# Altium schematic sheet FPGA CONFIG.SchDoc: XC7A3G-JTAG
size A4; Date: 9 AUG 2026; Engineer: Parsa Malekpour; Revision: 1.0.0; SheetNumber: 7; SheetTotal: 18
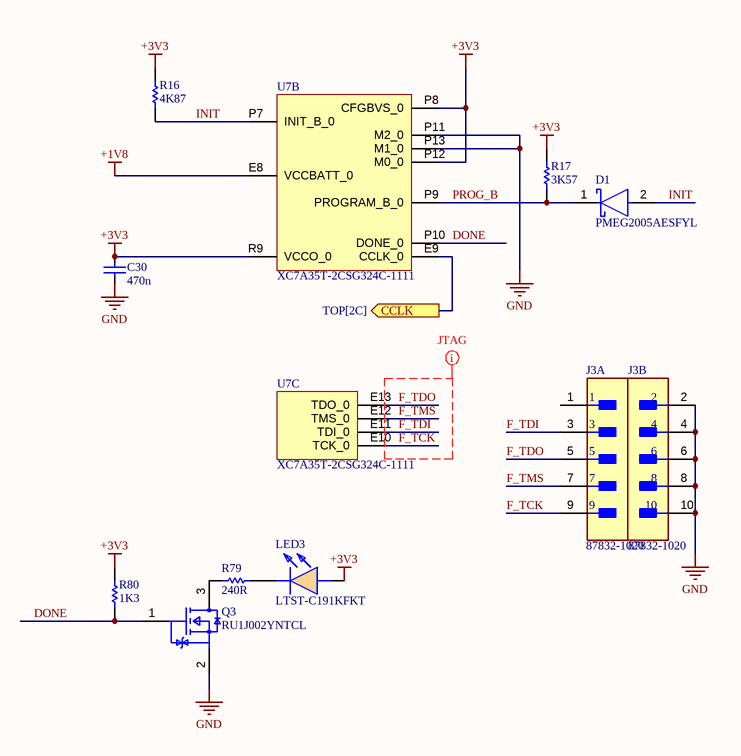
[diagram p0: FPGA CONFIG.SchDoc]

## Parts
C30  value 470n  [FP-C1005-050-0_05-IPC_C]  (hidden comment: C1005X5R1E474K050BB)
D1  PMEG2005AESFYL  [FP-PMEG2005AESFYL-MFG]
J3  87832-1020  [FP-87832-1020-MFG]  (parts A,B of 2)
LED3  LTST-C191KFKT  [LEDC1608X55N]
Q3  RU1J002YNTCL  [FP-UMT3F-MFG]
R16  value 4K87  [RESC1005X40X25LL05T10]  (hidden comment: RC0402FR-074K87L)
R17  value 3K57  [RESC1005X40X25LL05T10]  (hidden comment: RC0402FR-073K57L)
R79  value 240R  [RESC1005X40X25LL05T10]  (hidden comment: RC0402FR-07240RL)
R80  value 1K3  [RESC1005X40X25LL05T10]  (hidden comment: RC0402FR-071K3L)
U7  XC7A35T-2CSG324C-1111  [BGA324C80P18X18_1500X1500X150]  (parts B,C of 8)

## Ports
CCLK (out, see TOP[2C])

## Nets
+1V8: U7.E8(VCCBATT_0)
+3V3: C30.1 LED3.2(A) R16.2 R17.1 R80.2 U7.P8(CFGBVS_0) U7.P12(M0_0) U7.R9(VCCO_0)
GND: C30.2 J3.2 J3.4 J3.6 J3.8 J3.10 Q3.2(S) U7.P11(M2_0) U7.P13(M1_0)
CCLK: U7.E9(CCLK_0) ; port CCLK
DONE: Q3.1(G) R80.1 U7.P10(DONE_0)
F_TCK: J3.9 U7.E10(TCK_0)
F_TDI: J3.3 U7.E11(TDI_0)
F_TDO: J3.5 U7.E13(TDO_0)
F_TMS: J3.7 U7.E12(TMS_0)
INIT: D1.2(A) R16.1 U7.P7(INIT_B_0)
PROG_B: D1.1(K) R17.2 U7.P9(PROGRAM_B_0)
NetLED3_1: LED3.1(K) R79.2
NetQ3_3: Q3.3(D) R79.1

Not connected (* = marked no-connect by the designer): J3 1

## Layout directives
net class JTAG; rule Impedance Constraint [Min = 45.00    Max = 55.00    ]: F_TCK, F_TDI, F_TDO, F_TMS

## Notes on the sheet
- TITLE
- REV
- Date
- A4
- FILE NAME
- CODE
- SHEET
- Engineer
- OF

## Library data of the parts
C30 = C1005X5R1E474K050BB: Multilayer Ceramic Capacitors 470nF ±10% 25V X5R SMD 0402; Dissipation Factor: 10%; Case Code (Metric): 1005; RoHS Compliant: Yes; Lead Free: Lead Free; Length: 1mm; Case/Package: 0402; Termination: SMD/SMT; Dielectric Material: Ceramic; Dielectric: X5R; Depth: 0.5mm; Series: C; Voltage: 25V; Tolerance: 10%; Packaging: Tape and Reel; Resistor Type: Ceramic; Min Operating Temperature: -55°C; Width: 0.02inch; Thickness: 500um; Package Quantity: 10000; Case Code (Imperial): 0402; Construction: Flat; Height: 0.5mm; REACH SVHC: No SVHC; Radiation Hardening: No; Weight: 2.3E-05oz; Mount: Surface Mount; Voltage Rating (DC): 25V; Max Operating Temperature: 85°C; Part Number: C1005X5R1E474K050BB; Voltage Rating: 25V
D1 = PMEG2005AESFYL: DIODE SCHOTTKY 20V 0.5A SOD962; Manufacturer: Nexperia; Max Junction Temp: +150°C; Peak Reverse Current: 10uA; Capacitance: 25pF; Forward Current: 0.71A; Max Surge Forward Current: 4.5A; Value: 25pF; Lead Free: Yes; ComponentLink2Description: Datasheet; Octopart: https://octopart.com/pmeg2005aesfyl-nexperia-78741393; Ambient Temperature Range High: +150°C; Height: 0.32mm; Footprint Url: https://assets.nexperia.com/documents/outline-drawing/SOD962-2.pdf; Automotive: No; Device Class L2: Diodes; Ambient Temperature Range Low: -55°C; Device Class L3: Schottky Diodes; ComponentLink2URL: https://assets.nexperia.com/documents/data-sheet/PMEG2005AESF.pdf; Reverse Voltage: 20V; Temperature: to +150°C; Temperature Range High: +150°C; Device Class L1: Discrete Semiconductors; RoHS: TRUE; Digikey Description: DIODE SCHOTTKY 20V 0.5A SOD962; Category: Diode; Package: SOD962; Manufacturer Part Number: PMEG2005AESFYL
J3 = CMP-04776-000811-1: CONN HEADER SMD 10POS 2MM; Number of Positions: 10; Current Rating: 2A; Connector Type: Male Pin; Voltage Rating: 125V; Gender: Male; Row Spacing: 0.079inch; Contact Mating Length: 0.141inch; Contact Type: Male Pin; Series: Milli-Grid™ 87832; RoHS Compliant: Yes; Depth: 6.35mm; Orientation: Straight; Contact Material: Bronze; Mount: Surface Mount; Min Operating Temperature: -55°C; Housing Color: Black; Pitch: 2mm; Length: 12.65mm; Housing Material: Nylon; Packaging: Rail/Tube; Termination: Solder; Max Operating Temperature: 105°C; Contact Plating: Gold; Number of Rows: 2; Color: Black; Number of Contacts: 10
LED3 = LTST-C191KFKT: LED; Manufacturer: Lite-On; Value: Orange; Datasheet Link: https://datasheet.datasheetarchive.com/originals/distributors/Datasheets-305/79307.pdf; Height: 0.55mm; Mouser Part Number: 859-LTST-C191KFKT; Mouser Price/Stock: https://www.mouser.co.uk/ProductDetail/Lite-On/LTST-C191KFKT?qs=1bx9pL%2Fk%252BiAv01YAc0eitQ%3D%3D; Arrow Part Number: LTST-C191KFKT; Arrow Price/Stock: https://www.arrow.com/en/products/ltst-c191kfkt/lite-on-technology.html?utm_currency=USD&region=nac; Part Number: LTST-C191KFKT
Q3 = RU1J002YNTCL: MOSFET N-CH 50V 0.2A UMT3F; Manufacturer: Rohm; Drain To Source Resistance: 1.6Ω; Depletion Mode: False; Continuous Drain Current: 200mA; Pulse Drain Current: 800mA; Turn On Delay Time: 5ns; Threshold Vgs Max: 0.8V; Rthja Max: 833°C/W; Max Forward Diode Voltage: 1.2V; Max Junction Temp: +150°C; Standoff Height: 0mm; Input Capacitace At Vds: 26pF @ 10V; Number Of Channels: 1; Power Dissipation: 150mW; Gate To Source Voltage: 8V; Turn Off Delay Time: 17ns; Threshold Vgs Min: 0.3V; Lead Free: Yes; Device Class L3: MOSFETs; Drain To Source Voltage: 50V; ComponentLink2URL: https://d1d2qsbl8m0m72.cloudfront.net/en/products/databook/datasheet/discrete/transistor/mosfet/ru1j002yn-e.pdf; RoHS: TRUE; Device Class L2: Transistors; Mouser Description: MOSFET 0.9V Drive Nch MOSFET; Category: Trans; Octopart: https://octopart.com/ru1j002yntcl-rohm-47197697; Temperature: to +150°C; Height: 1.05mm; Number Of N Channels: 1; Package: UMT3F; ComponentLink2Description: Datasheet; Automotive: No; Drain To Source Breakdown Voltage: 50V; Device Class L1: Discrete Semiconductors; Digikey Description: MOSFET N-CH 50V 0.2A UMT3F; Manufacturer Part Number: RU1J002YNTCL; Temperature Range High: +150°C
R16 = RC0402FR-074K87L: Manufacturer: Yageo / Phycomp; Part Number: RC0402FR-074K87L
R17 = RC0402FR-073K57L: Manufacturer: Yageo; Part Number: RC0402FR-073K57L; Parameter 1: *
R79 = RC0402FR-07240RL: 240R 0.063W 1% 0402 (1005 Metric)  SMD; Case-Metric: 1005; Case-EIA: 0402; Power: 0.063 W; Tolerance: 1 %; Technology: SMT; Part Number: RC0402FR-07240RL; Parameter 1: *
R80 = RC0402FR-071K3L: Manufacturer: Yageo / Phycomp; Part Number: RC0402FR-071K3L
U7 = XC7A35T-2CSG324C-1111: Integrated Circuit; Manufacturer_Name: AMD; Datasheet Link: https://www.xilinx.com/support/documentation/data_sheets/ds181_Artix_7_Data_Sheet.pdf; Height: 1.5mm; Manufacturer_Part_Number: XC7A35T-2CSG324C; Mouser Part Number: 217-XC7A35T-2CSG324C; Mouser Price/Stock: https://www.mouser.co.uk/ProductDetail/AMD-Xilinx/XC7A35T-2CSG324C?qs=rrS6PyfT74fMA9%2F3WtPZmw%3D%3D